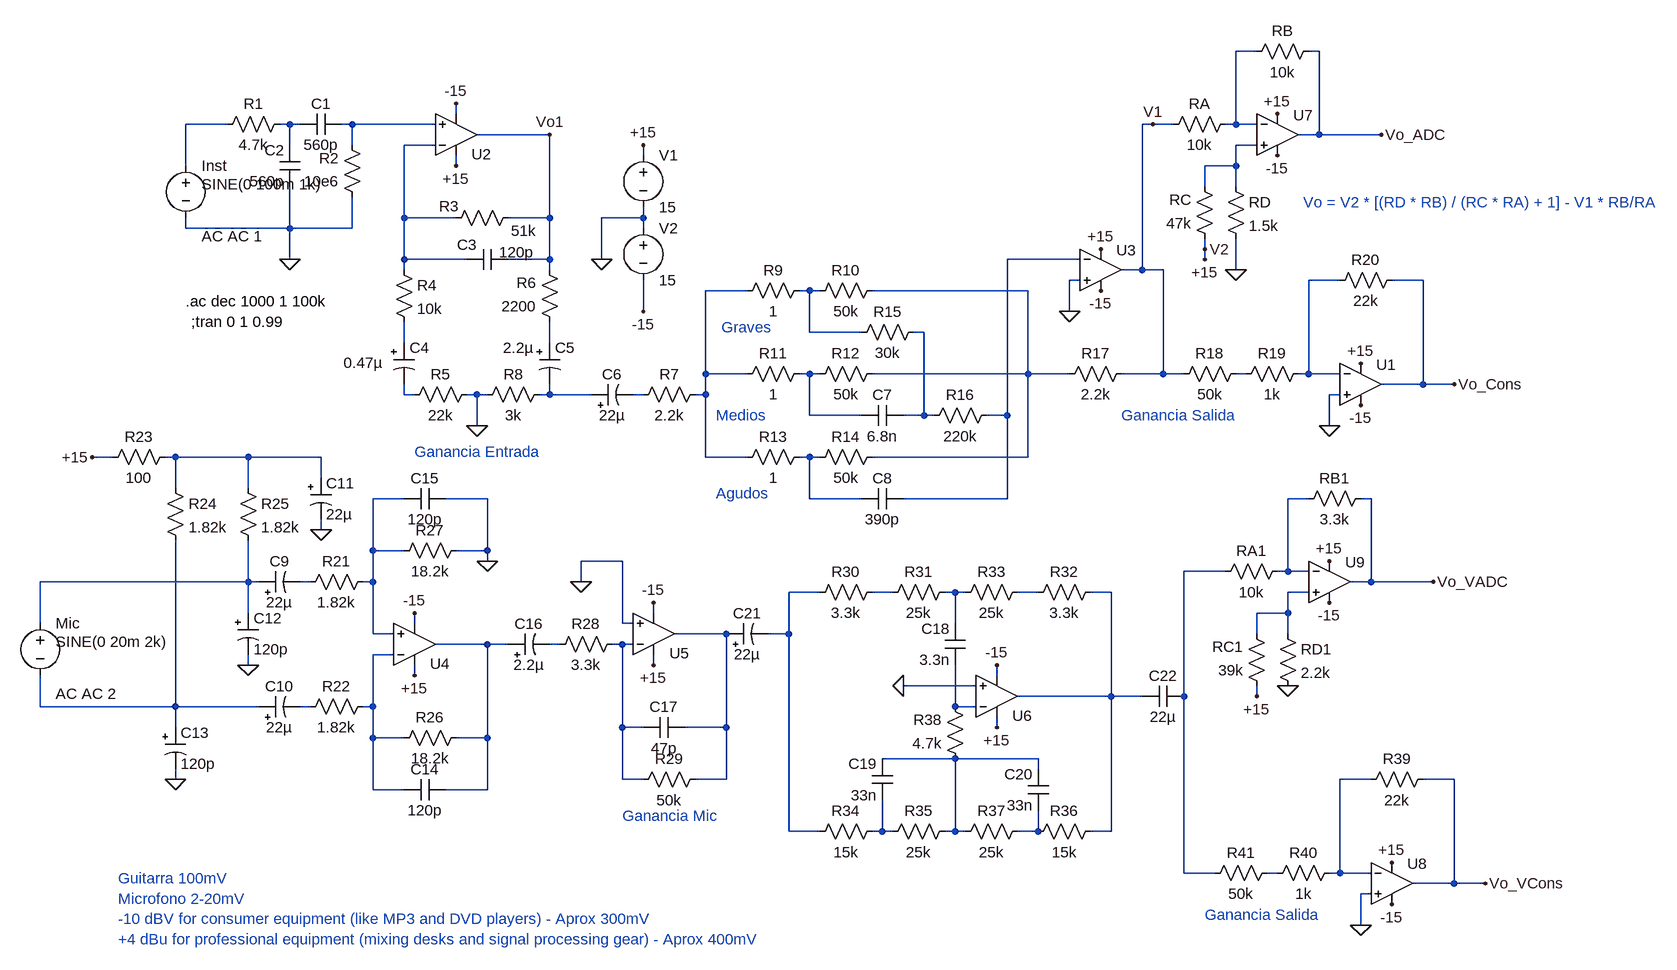
[diagram p0: schematic Amp_Comun+Voz.asc]
Amp_Comun+Voz.asc, the LTspice schematic file:
Version 4
SHEET 1 2668 1396
WIRE 1344 0 1312 0
WIRE 1440 0 1424 0
WIRE 112 96 112 80
WIRE -240 112 -304 112
WIRE -144 112 -160 112
WIRE -128 112 -144 112
WIRE -48 112 -64 112
WIRE 80 112 -48 112
WIRE 1184 112 1168 112
WIRE 1216 112 1184 112
WIRE 1312 112 1312 0
WIRE 1312 112 1296 112
WIRE 1344 112 1312 112
WIRE 256 128 144 128
WIRE 1440 128 1440 0
WIRE 1440 128 1408 128
WIRE 1536 128 1440 128
WIRE -144 144 -144 112
WIRE -48 144 -48 112
WIRE 80 144 32 144
WIRE 1344 144 1312 144
WIRE 400 160 400 144
WIRE -304 176 -304 112
WIRE 112 176 112 160
WIRE 1312 176 1312 144
WIRE 1312 176 1264 176
WIRE 1264 208 1264 176
WIRE 1312 208 1312 176
WIRE 32 256 32 144
WIRE 112 256 32 256
WIRE 256 256 256 128
WIRE 256 256 192 256
WIRE 400 256 400 240
WIRE 400 256 336 256
WIRE -304 272 -304 256
WIRE -144 272 -144 208
WIRE -144 272 -304 272
WIRE -48 272 -48 224
WIRE -48 272 -144 272
WIRE 400 272 400 256
WIRE 1264 304 1264 288
WIRE -144 320 -144 272
WIRE 32 320 32 256
WIRE 128 320 32 320
WIRE 256 320 256 256
WIRE 256 320 192 320
WIRE 336 320 336 256
WIRE 1072 320 960 320
WIRE 1264 320 1264 304
WIRE 32 336 32 320
WIRE 256 336 256 320
WIRE 1168 336 1168 112
WIRE 1168 336 1136 336
WIRE 1200 336 1168 336
WIRE 1312 336 1312 288
WIRE 1072 352 1056 352
WIRE 1472 352 1424 352
WIRE 1600 352 1552 352
WIRE 560 368 496 368
WIRE 656 368 640 368
WIRE 672 368 656 368
WIRE 992 368 752 368
WIRE 400 400 400 352
WIRE 1056 400 1056 352
WIRE 656 432 656 368
WIRE 736 432 656 432
WIRE 832 432 816 432
WIRE 32 448 32 416
WIRE 256 448 256 416
WIRE 496 496 496 368
WIRE 560 496 496 496
WIRE 656 496 640 496
WIRE 672 496 656 496
WIRE 992 496 992 368
WIRE 992 496 752 496
WIRE 1056 496 992 496
WIRE 1200 496 1200 336
WIRE 1200 496 1136 496
WIRE 1232 496 1200 496
WIRE 1328 496 1312 496
WIRE 1424 496 1424 352
WIRE 1424 496 1408 496
WIRE 1472 496 1424 496
WIRE 1600 512 1600 352
WIRE 1600 512 1536 512
WIRE 1648 512 1600 512
WIRE 32 528 32 512
WIRE 48 528 32 528
WIRE 144 528 128 528
WIRE 160 528 144 528
WIRE 256 528 256 512
WIRE 256 528 240 528
WIRE 320 528 256 528
WIRE 400 528 384 528
WIRE 496 528 496 496
WIRE 496 528 480 528
WIRE 1472 528 1456 528
WIRE 656 560 656 496
WIRE 736 560 656 560
WIRE 832 560 832 432
WIRE 832 560 800 560
WIRE 848 560 832 560
WIRE 960 560 960 320
WIRE 960 560 928 560
WIRE 144 576 144 528
WIRE 1456 576 1456 528
WIRE -416 624 -448 624
WIRE -320 624 -336 624
WIRE -208 624 -320 624
WIRE -96 624 -208 624
WIRE 496 624 496 528
WIRE 560 624 496 624
WIRE 656 624 640 624
WIRE 672 624 656 624
WIRE 992 624 992 496
WIRE 992 624 752 624
WIRE -96 656 -96 624
WIRE -320 672 -320 624
WIRE -208 672 -208 624
WIRE 32 688 -16 688
WIRE 160 688 96 688
WIRE 656 688 656 624
WIRE 736 688 656 688
WIRE 960 688 960 560
WIRE 960 688 800 688
WIRE 1424 688 1392 688
WIRE 1520 688 1504 688
WIRE -96 736 -96 720
WIRE -16 768 -16 688
WIRE 32 768 -16 768
WIRE 160 768 160 688
WIRE 160 768 112 768
WIRE 160 784 160 768
WIRE 368 784 304 784
WIRE 1296 800 1232 800
WIRE 1392 800 1392 688
WIRE 1392 800 1376 800
WIRE 1424 800 1392 800
WIRE -208 816 -208 752
WIRE -208 816 -528 816
WIRE -192 816 -208 816
WIRE -112 816 -128 816
WIRE -16 816 -16 768
WIRE -16 816 -32 816
WIRE 304 816 304 784
WIRE 1520 816 1520 688
WIRE 1520 816 1488 816
WIRE 1616 816 1520 816
WIRE 672 832 624 832
WIRE 784 832 752 832
WIRE 880 832 864 832
WIRE 896 832 880 832
WIRE 1008 832 976 832
WIRE 1120 832 1088 832
WIRE 1424 832 1392 832
WIRE -208 864 -208 816
WIRE 416 864 416 848
WIRE 1392 864 1392 832
WIRE 1392 864 1344 864
WIRE -528 880 -528 816
WIRE 48 880 48 864
WIRE 368 880 368 784
WIRE 384 880 368 880
WIRE 880 880 880 832
WIRE -16 896 -16 816
WIRE 16 896 -16 896
WIRE 528 896 448 896
WIRE 624 896 624 832
WIRE 624 896 592 896
WIRE 1344 896 1344 864
WIRE 1392 896 1392 864
WIRE 160 912 80 912
WIRE 192 912 160 912
WIRE 272 912 256 912
WIRE 368 912 352 912
WIRE 384 912 368 912
WIRE 16 928 -16 928
WIRE -208 944 -208 928
WIRE 416 944 416 928
WIRE 48 960 48 944
WIRE 944 960 944 944
WIRE 912 976 800 976
WIRE 1120 992 1120 832
WIRE 1120 992 976 992
WIRE 1168 992 1120 992
WIRE 1232 992 1232 800
WIRE 1344 992 1344 976
WIRE -528 1008 -528 960
WIRE -320 1008 -320 752
WIRE -320 1008 -528 1008
WIRE -192 1008 -320 1008
WIRE -112 1008 -128 1008
WIRE -16 1008 -16 928
WIRE -16 1008 -32 1008
WIRE 880 1008 880 944
WIRE 912 1008 880 1008
WIRE -320 1040 -320 1008
WIRE 368 1040 368 912
WIRE 400 1040 368 1040
WIRE 528 1040 528 896
WIRE 528 1040 464 1040
WIRE 944 1040 944 1024
WIRE -16 1056 -16 1008
WIRE 32 1056 -16 1056
WIRE 160 1056 160 912
WIRE 160 1056 112 1056
WIRE 880 1088 768 1088
WIRE 1008 1088 880 1088
WIRE 1008 1104 1008 1088
WIRE -320 1120 -320 1104
WIRE 368 1120 368 1040
WIRE 400 1120 368 1120
WIRE 528 1120 528 1040
WIRE 528 1120 480 1120
WIRE 1520 1120 1472 1120
WIRE 1648 1120 1600 1120
WIRE -16 1136 -16 1056
WIRE 32 1136 -16 1136
WIRE 160 1136 160 1056
WIRE 160 1136 96 1136
WIRE 624 1200 624 896
WIRE 672 1200 624 1200
WIRE 768 1200 768 1152
WIRE 768 1200 752 1200
WIRE 784 1200 768 1200
WIRE 880 1200 880 1088
WIRE 880 1200 864 1200
WIRE 896 1200 880 1200
WIRE 1008 1200 1008 1168
WIRE 1008 1200 976 1200
WIRE 1120 1200 1120 992
WIRE 1120 1200 1088 1200
WIRE 1232 1264 1232 992
WIRE 1280 1264 1232 1264
WIRE 1376 1264 1360 1264
WIRE 1472 1264 1472 1120
WIRE 1472 1264 1456 1264
WIRE 1520 1264 1472 1264
WIRE 1648 1280 1648 1120
WIRE 1648 1280 1584 1280
WIRE 1696 1280 1648 1280
WIRE 1520 1296 1504 1296
WIRE 1504 1344 1504 1296
FLAG 112 176 +15
FLAG 400 144 +15
FLAG 400 400 -15
FLAG 112 80 -15
FLAG 336 320 0
FLAG -144 320 0
FLAG 144 576 0
FLAG 1104 304 +15
FLAG 1104 368 -15
FLAG 1056 400 0
FLAG 256 128 Vo1
FLAG 1536 128 Vo_ADC
FLAG 1504 480 +15
FLAG 1504 544 -15
FLAG 1456 576 0
FLAG 1648 512 Vo_Cons
FLAG 48 960 +15
FLAG 48 864 -15
FLAG -448 624 +15
FLAG -96 736 0
FLAG -208 944 0
FLAG -320 1120 0
FLAG 160 784 0
FLAG 416 944 +15
FLAG 416 848 -15
FLAG 304 816 0
FLAG 944 1040 +15
FLAG 944 944 -15
FLAG 800 976 0
FLAG 1376 96 +15
FLAG 1376 160 -15
FLAG 1312 336 0
FLAG 1264 320 +15
FLAG 1184 112 V1
FLAG 1264 304 V2
FLAG 1552 1248 +15
FLAG 1552 1312 -15
FLAG 1504 1344 0
FLAG 1696 1280 Vo_VCons
FLAG 1616 816 Vo_VADC
FLAG 1456 784 +15
FLAG 1456 848 -15
FLAG 1392 976 0
FLAG 1344 992 +15
SYMBOL voltage 400 144 R0
WINDOW 123 0 0 Left 0
WINDOW 39 0 0 Left 0
SYMATTR InstName V1
SYMATTR Value 15
SYMBOL voltage 400 256 R0
WINDOW 123 0 0 Left 0
WINDOW 39 0 0 Left 0
SYMATTR InstName V2
SYMATTR Value 15
SYMBOL voltage -304 160 R0
WINDOW 123 24 124 Left 2
WINDOW 39 0 0 Left 0
WINDOW 3 24 44 Left 2
SYMATTR Value2 AC AC 1
SYMATTR Value SINE(0 100m 1k)
SYMATTR InstName Inst
SYMBOL res -144 96 R90
WINDOW 0 0 56 VBottom 2
WINDOW 3 32 56 VTop 2
SYMATTR InstName R1
SYMATTR Value 4.7k
SYMBOL res -32 240 R180
WINDOW 0 36 76 Left 2
WINDOW 3 36 40 Left 2
SYMATTR InstName R2
SYMATTR Value 10e6
SYMBOL res 96 272 R270
WINDOW 0 18 5 VTop 2
WINDOW 3 12 120 VBottom 2
SYMATTR InstName R3
SYMATTR Value 51k
SYMBOL res 16 320 R0
SYMATTR InstName R4
SYMATTR Value 10k
SYMBOL res 272 432 R180
WINDOW 0 36 76 Left 2
WINDOW 3 36 40 Left 2
SYMATTR InstName R6
SYMATTR Value 2200
SYMBOL res 384 544 R270
WINDOW 0 32 56 VTop 2
WINDOW 3 0 56 VBottom 2
SYMATTR InstName R7
SYMATTR Value 2.2k
SYMBOL cap -64 96 R90
WINDOW 0 0 32 VBottom 2
WINDOW 3 32 32 VTop 2
SYMATTR InstName C1
SYMATTR Value 560p
SYMBOL cap -128 208 R180
WINDOW 0 24 56 Left 2
WINDOW 3 24 8 Left 2
SYMATTR InstName C2
SYMATTR Value 560p
SYMBOL cap 128 336 R270
WINDOW 0 23 1 VTop 2
WINDOW 3 43 77 VBottom 2
SYMATTR InstName C3
SYMATTR Value 120p
SYMBOL polcap 16 448 R0
WINDOW 3 -77 31 Left 2
SYMATTR Value 0.47µ
SYMATTR InstName C4
SYMBOL polcap 240 448 R0
WINDOW 3 -56 8 Left 2
SYMATTR Value 2.2µ
SYMATTR InstName C5
SYMBOL polcap 320 544 R270
WINDOW 0 32 32 VTop 2
WINDOW 3 0 32 VBottom 2
SYMATTR InstName C6
SYMATTR Value 22µ
SYMBOL OpAmps\\UniversalOpamp2 112 128 M180
WINDOW 0 24 -30 Left 2
SYMATTR InstName U2
SYMBOL res 144 512 R90
WINDOW 0 0 56 VBottom 2
WINDOW 3 32 56 VTop 2
SYMATTR InstName R5
SYMATTR Value 22k
SYMBOL res 256 512 R90
WINDOW 0 0 56 VBottom 2
WINDOW 3 32 56 VTop 2
SYMATTR InstName R8
SYMATTR Value 3k
SYMBOL res 656 352 R90
WINDOW 0 0 56 VBottom 2
WINDOW 3 32 56 VTop 2
SYMATTR InstName R9
SYMATTR Value 1
SYMBOL res 768 352 R90
WINDOW 0 0 56 VBottom 2
WINDOW 3 32 56 VTop 2
SYMATTR InstName R10
SYMATTR Value 50k
SYMBOL res 656 480 R90
WINDOW 0 0 56 VBottom 2
WINDOW 3 32 56 VTop 2
SYMATTR InstName R11
SYMATTR Value 1
SYMBOL res 768 480 R90
WINDOW 0 0 56 VBottom 2
WINDOW 3 32 56 VTop 2
SYMATTR InstName R12
SYMATTR Value 50k
SYMBOL res 656 608 R90
WINDOW 0 0 56 VBottom 2
WINDOW 3 32 56 VTop 2
SYMATTR InstName R13
SYMATTR Value 1
SYMBOL res 768 608 R90
WINDOW 0 0 56 VBottom 2
WINDOW 3 32 56 VTop 2
SYMATTR InstName R14
SYMATTR Value 50k
SYMBOL cap 800 544 R90
WINDOW 0 0 32 VBottom 2
WINDOW 3 32 32 VTop 2
SYMATTR InstName C7
SYMATTR Value 6.8n
SYMBOL cap 800 672 R90
WINDOW 0 0 32 VBottom 2
WINDOW 3 32 32 VTop 2
SYMATTR InstName C8
SYMATTR Value 390p
SYMBOL res 832 416 R90
WINDOW 0 0 56 VBottom 2
WINDOW 3 32 56 VTop 2
SYMATTR InstName R15
SYMATTR Value 30k
SYMBOL res 944 544 R90
WINDOW 0 0 56 VBottom 2
WINDOW 3 32 56 VTop 2
SYMATTR InstName R16
SYMATTR Value 220k
SYMBOL OpAmps\\UniversalOpamp2 1104 336 R0
WINDOW 0 24 -30 Left 2
SYMATTR InstName U3
SYMBOL res 1152 480 R90
WINDOW 0 0 56 VBottom 2
WINDOW 3 32 56 VTop 2
SYMATTR InstName R17
SYMATTR Value 2.2k
SYMBOL OpAmps\\UniversalOpamp2 1504 512 R0
WINDOW 0 24 -30 Left 2
SYMATTR InstName U1
SYMBOL res 1328 480 R90
WINDOW 0 0 56 VBottom 2
WINDOW 3 32 56 VTop 2
SYMATTR InstName R18
SYMATTR Value 50k
SYMBOL res 1568 336 R90
WINDOW 0 0 56 VBottom 2
WINDOW 3 32 56 VTop 2
SYMATTR InstName R20
SYMATTR Value 22k
SYMBOL res 1424 480 R90
WINDOW 0 0 56 VBottom 2
WINDOW 3 32 56 VTop 2
SYMATTR InstName R19
SYMATTR Value 1k
SYMBOL voltage -528 864 R0
WINDOW 123 24 124 Left 2
WINDOW 39 0 0 Left 0
WINDOW 3 24 44 Left 2
SYMATTR Value2 AC AC 2
SYMATTR InstName Mic
SYMATTR Value SINE(0 20m 2k)
SYMBOL OpAmps\\UniversalOpamp2 48 912 M180
WINDOW 0 24 -30 Left 2
SYMATTR InstName U4
SYMBOL res -128 832 R270
WINDOW 0 32 56 VTop 2
WINDOW 3 0 56 VBottom 2
SYMATTR InstName R21
SYMATTR Value 1.82k
SYMBOL polcap -192 832 R270
WINDOW 0 32 32 VTop 2
WINDOW 3 0 32 VBottom 2
SYMATTR InstName C9
SYMATTR Value 22µ
SYMBOL res -128 1024 R270
WINDOW 0 32 56 VTop 2
WINDOW 3 0 56 VBottom 2
SYMATTR InstName R22
SYMATTR Value 1.82k
SYMBOL polcap -192 1024 R270
WINDOW 0 32 32 VTop 2
WINDOW 3 0 32 VBottom 2
SYMATTR InstName C10
SYMATTR Value 22µ
SYMBOL res -320 608 R90
WINDOW 0 0 56 VBottom 2
WINDOW 3 32 56 VTop 2
SYMATTR InstName R23
SYMATTR Value 100
SYMBOL res -336 656 R0
SYMATTR InstName R24
SYMATTR Value 1.82k
SYMBOL res -224 656 R0
SYMATTR InstName R25
SYMATTR Value 1.82k
SYMBOL polcap -112 656 R0
SYMATTR InstName C11
SYMATTR Value 22µ
SYMBOL polcap -224 864 R0
SYMATTR InstName C12
SYMATTR Value 120p
SYMBOL polcap -336 1040 R0
SYMATTR InstName C13
SYMATTR Value 120p
SYMBOL res 16 1072 R270
WINDOW 0 32 56 VTop 2
WINDOW 3 0 56 VBottom 2
SYMATTR InstName R26
SYMATTR Value 18.2k
SYMBOL cap 96 1120 R90
WINDOW 0 0 32 VBottom 2
WINDOW 3 32 32 VTop 2
SYMATTR InstName C14
SYMATTR Value 120p
SYMBOL res 16 784 R270
WINDOW 0 32 56 VTop 2
WINDOW 3 0 56 VBottom 2
SYMATTR InstName R27
SYMATTR Value 18.2k
SYMBOL cap 96 672 R90
WINDOW 0 0 32 VBottom 2
WINDOW 3 32 32 VTop 2
SYMATTR InstName C15
SYMATTR Value 120p
SYMBOL OpAmps\\UniversalOpamp2 416 896 M180
WINDOW 0 24 -30 Left 2
SYMATTR InstName U5
SYMBOL res 256 928 R270
WINDOW 0 32 56 VTop 2
WINDOW 3 0 56 VBottom 2
SYMATTR InstName R28
SYMATTR Value 3.3k
SYMBOL polcap 192 928 R270
WINDOW 0 32 32 VTop 2
WINDOW 3 0 32 VBottom 2
SYMATTR InstName C16
SYMATTR Value 2.2µ
SYMBOL res 496 1104 R90
WINDOW 0 0 56 VBottom 2
WINDOW 3 32 56 VTop 2
SYMATTR InstName R29
SYMATTR Value 50k
SYMBOL cap 464 1024 R90
WINDOW 0 0 32 VBottom 2
WINDOW 3 32 32 VTop 2
SYMATTR InstName C17
SYMATTR Value 47p
SYMBOL res 768 816 R90
WINDOW 0 0 56 VBottom 2
WINDOW 3 32 56 VTop 2
SYMATTR InstName R30
SYMATTR Value 3.3k
SYMBOL res 880 816 R90
WINDOW 0 0 56 VBottom 2
WINDOW 3 32 56 VTop 2
SYMATTR InstName R31
SYMATTR Value 25k
SYMBOL res 1104 816 R90
WINDOW 0 0 56 VBottom 2
WINDOW 3 32 56 VTop 2
SYMATTR InstName R32
SYMATTR Value 3.3k
SYMBOL res 992 816 R90
WINDOW 0 0 56 VBottom 2
WINDOW 3 32 56 VTop 2
SYMATTR InstName R33
SYMATTR Value 25k
SYMBOL cap 896 944 R180
WINDOW 0 24 56 Left 2
WINDOW 3 24 8 Left 2
SYMATTR InstName C18
SYMATTR Value 3.3n
SYMBOL OpAmps\\UniversalOpamp2 944 992 M180
WINDOW 0 24 -30 Left 2
SYMATTR InstName U6
SYMBOL res 768 1184 R90
WINDOW 0 0 56 VBottom 2
WINDOW 3 32 56 VTop 2
SYMATTR InstName R34
SYMATTR Value 15k
SYMBOL res 880 1184 R90
WINDOW 0 0 56 VBottom 2
WINDOW 3 32 56 VTop 2
SYMATTR InstName R35
SYMATTR Value 25k
SYMBOL res 1104 1184 R90
WINDOW 0 0 56 VBottom 2
WINDOW 3 32 56 VTop 2
SYMATTR InstName R36
SYMATTR Value 15k
SYMBOL res 992 1184 R90
WINDOW 0 0 56 VBottom 2
WINDOW 3 32 56 VTop 2
SYMATTR InstName R37
SYMATTR Value 25k
SYMBOL cap 784 1152 R180
WINDOW 0 24 56 Left 2
WINDOW 3 24 8 Left 2
SYMATTR InstName C19
SYMATTR Value 33n
SYMBOL cap 1024 1168 R180
WINDOW 0 24 56 Left 2
WINDOW 3 24 8 Left 2
SYMATTR InstName C20
SYMATTR Value 33n
SYMBOL res 896 1104 R180
WINDOW 0 36 76 Left 2
WINDOW 3 36 40 Left 2
SYMATTR InstName R38
SYMATTR Value 4.7k
SYMBOL polcap 528 912 R270
WINDOW 0 32 32 VTop 2
WINDOW 3 0 32 VBottom 2
SYMATTR InstName C21
SYMATTR Value 22µ
SYMBOL OpAmps\\UniversalOpamp2 1376 128 R0
WINDOW 0 24 -30 Left 2
SYMATTR InstName U7
SYMBOL res 1280 304 R180
WINDOW 0 36 76 Left 2
WINDOW 3 36 40 Left 2
SYMATTR InstName RC
SYMATTR Value 47k
SYMBOL res 1296 192 R0
SYMATTR InstName RD
SYMATTR Value 1.5k
SYMBOL res 1200 128 R270
WINDOW 0 32 56 VTop 2
WINDOW 3 0 56 VBottom 2
SYMATTR InstName RA
SYMATTR Value 10k
SYMBOL res 1328 16 R270
WINDOW 0 32 56 VTop 2
WINDOW 3 0 56 VBottom 2
SYMATTR InstName RB
SYMATTR Value 10k
SYMBOL OpAmps\\UniversalOpamp2 1552 1280 R0
WINDOW 0 24 -30 Left 2
SYMATTR InstName U8
SYMBOL res 1616 1104 R90
WINDOW 0 0 56 VBottom 2
WINDOW 3 32 56 VTop 2
SYMATTR InstName R39
SYMATTR Value 22k
SYMBOL res 1472 1248 R90
WINDOW 0 0 56 VBottom 2
WINDOW 3 32 56 VTop 2
SYMATTR InstName R40
SYMATTR Value 1k
SYMBOL res 1376 1248 R90
WINDOW 0 0 56 VBottom 2
WINDOW 3 32 56 VTop 2
SYMATTR InstName R41
SYMATTR Value 50k
SYMBOL OpAmps\\UniversalOpamp2 1456 816 R0
WINDOW 0 24 -30 Left 2
SYMATTR InstName U9
SYMBOL res 1360 992 R180
WINDOW 0 36 76 Left 2
WINDOW 3 36 40 Left 2
SYMATTR InstName RC1
SYMATTR Value 39k
SYMBOL res 1376 880 R0
SYMATTR InstName RD1
SYMATTR Value 2.2k
SYMBOL res 1280 816 R270
WINDOW 0 32 56 VTop 2
WINDOW 3 0 56 VBottom 2
SYMATTR InstName RA1
SYMATTR Value 10k
SYMBOL res 1408 704 R270
WINDOW 0 32 56 VTop 2
WINDOW 3 0 56 VBottom 2
SYMATTR InstName RB1
SYMATTR Value 3.3k
SYMBOL cap 1168 1008 R270
WINDOW 0 32 32 VTop 2
WINDOW 3 0 32 VBottom 2
SYMATTR InstName C22
SYMATTR Value 22µ
TEXT -304 384 Left 2 !.ac dec 1000 1 100k
TEXT 512 680 Left 2 ;Agudos
TEXT 512 560 Left 2 ;Medios
TEXT 520 424 Left 2 ;Graves
TEXT 48 616 Left 2 ;Ganancia Entrada
TEXT 1136 560 Left 2 ;Ganancia Salida
TEXT 368 1176 Left 2 ;Ganancia Mic
TEXT -296 416 Left 2 !;tran 0 1 0.99
TEXT -408 1272 Left 2 ;Guitarra 100mV\nMicrofono 2-20mV\n-10 dBV for consumer equipment (like MP3 and DVD players) - Aprox 300mV\n+4 dBu for professional equipment (mixing desks and signal processing gear) - Aprox 400mV
TEXT 1416 232 Left 2 ;Vo = V2 * [(RD * RB) / (RC * RA) + 1] - V1 * RB/RA
TEXT 1264 1328 Left 2 ;Ganancia Salida

The netlist it stands for:
* Amp_Comun+Voz.asc
V1 V2 0 15
V2 0 -15 15
V§Inst N002 0 SINE(0 100m 1k) AC AC 1
R1 N003 N002 4.7k
R2 0 N004 10e6
R3 N005 Vo1 51k
R4 N005 N013 10k
R6 N014 Vo1 2200
R7 N019 N009 2.2k
C1 N004 N003 560p
C2 0 N003 560p
C3 N005 Vo1 120p
C4 N013 N017 0.47µ
C5 N014 N018 2.2µ
C6 N018 N019 22µ
XU2 N004 N005 V2 -15 Vo1 level.2 Avol=1Meg GBW=10Meg Slew=10Meg ilimit=25m rail=0 Vos=0 phimargin=45 en=0 enk=0 in=0 ink=0 Rin=500Meg  ; pins IN+ IN- V+ V- OUT
R5 0 N017 22k
R8 N018 0 3k
R9 N010 N009 1
R10 N011 N010 50k
R11 N015 N009 1
R12 N011 N015 50k
R13 N021 N009 1
R14 N011 N021 50k
C7 N012 N015 6.8n
C8 N007 N021 390p
R15 N012 N010 30k
R16 N007 N012 220k
XU3 0 N007 V2 -15 V1 level.2 Avol=1Meg GBW=10Meg Slew=10Meg ilimit=25m rail=0 Vos=0 phimargin=45 en=0 enk=0 in=0 ink=0 Rin=500Meg  ; pins IN+ IN- V+ V- OUT
R17 V1 N011 2.2k
XU1 0 N008 V2 -15 Vo_Cons level.2 Avol=1Meg GBW=10Meg Slew=10Meg ilimit=25m rail=0 Vos=0 phimargin=45 en=0 enk=0 in=0 ink=0 Rin=500Meg  ; pins IN+ IN- V+ V- OUT
R18 N016 V1 50k
R20 Vo_Cons N008 22k
R19 N008 N016 1k
V§Mic N025 N038 SINE(0 20m 2k) AC AC 2
XU4 N022 N037 V2 -15 N034 level.2 Avol=1Meg GBW=10Meg Slew=10Meg ilimit=25m rail=0 Vos=0 phimargin=45 en=0 enk=0 in=0 ink=0 Rin=500Meg  ; pins IN+ IN- V+ V- OUT
R21 N026 N022 1.82k
C9 N025 N026 22µ
R22 N039 N037 1.82k
C10 N038 N039 22µ
R23 N020 V2 100
R24 N020 N038 1.82k
R25 N020 N025 1.82k
C11 N020 0 22µ
C12 N025 0 120p
C13 N038 0 120p
R26 N037 N034 18.2k
C14 N034 N037 120p
R27 N022 0 18.2k
C15 0 N022 120p
XU5 0 N036 V2 -15 N033 level.2 Avol=1Meg GBW=10Meg Slew=10Meg ilimit=25m rail=0 Vos=0 phimargin=45 en=0 enk=0 in=0 ink=0 Rin=500Meg  ; pins IN+ IN- V+ V- OUT
R28 N035 N036 3.3k
C16 N034 N035 2.2µ
R29 N033 N036 50k
C17 N033 N036 47p
R30 N028 N027 3.3k
R31 N029 N028 25k
R32 N031 N030 3.3k
R33 N030 N029 25k
C18 N040 N029 3.3n
XU6 0 N040 V2 -15 N031 level.2 Avol=1Meg GBW=10Meg Slew=10Meg ilimit=25m rail=0 Vos=0 phimargin=45 en=0 enk=0 in=0 ink=0 Rin=500Meg  ; pins IN+ IN- V+ V- OUT
R34 N043 N027 15k
R35 N041 N043 25k
R36 N031 N044 15k
R37 N044 N041 25k
C19 N043 N041 33n
C20 N044 N041 33n
R38 N041 N040 4.7k
C21 N033 N027 22µ
XU7 N006 N001 V2 -15 Vo_ADC level.2 Avol=1Meg GBW=10Meg Slew=10Meg ilimit=25m rail=0 Vos=0 phimargin=45 en=0 enk=0 in=0 ink=0 Rin=500Meg  ; pins IN+ IN- V+ V- OUT
RC V2 N006 47k
RD N006 0 1.5k
RA V1 N001 10k
RB N001 Vo_ADC 10k
XU8 0 N042 V2 -15 Vo_VCons level.2 Avol=1Meg GBW=10Meg Slew=10Meg ilimit=25m rail=0 Vos=0 phimargin=45 en=0 enk=0 in=0 ink=0 Rin=500Meg  ; pins IN+ IN- V+ V- OUT
R39 Vo_VCons N042 22k
R40 N042 N045 1k
R41 N045 N024 50k
XU9 N032 N023 V2 -15 Vo_VADC level.2 Avol=1Meg GBW=10Meg Slew=10Meg ilimit=25m rail=0 Vos=0 phimargin=45 en=0 enk=0 in=0 ink=0 Rin=500Meg  ; pins IN+ IN- V+ V- OUT
RC1 V2 N032 39k
RD1 N032 0 2.2k
RA1 N024 N023 10k
RB1 N023 Vo_VADC 3.3k
C22 N031 N024 22µ
.ac dec 1000 1 100k
* Agudos
* Medios
* Graves
* Ganancia Entrada
* Ganancia Salida
* Ganancia Mic
;tran 0 1 0.99
* Guitarra 100mV
* Microfono 2-20mV
* -10 dBV for consumer equipment (like MP3 and DVD players) - Aprox 300mV
* +4 dBu for professional equipment (mixing desks and signal processing gear) - Aprox 400mV
* Vo = V2 * [(RD * RB) / (RC * RA) + 1] - V1 * RB/RA
* Ganancia Salida
.lib UniversalOpamps2.sub
.backanno
.end